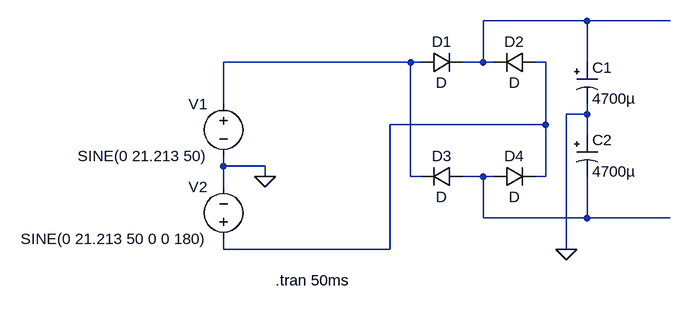
[diagram p0: schematic Rect and Filter.asc]
Rect and Filter.asc, the LTspice schematic file:
Version 4
SHEET 1 1676 728
WIRE 592 0 432 0
WIRE 720 0 592 0
WIRE 320 64 32 64
WIRE 336 64 320 64
WIRE 432 64 432 0
WIRE 432 64 400 64
WIRE 448 64 432 64
WIRE 528 64 512 64
WIRE 592 64 592 0
WIRE 32 128 32 64
WIRE 592 144 592 128
WIRE 592 144 560 144
WIRE 528 160 528 64
WIRE 528 160 288 160
WIRE 592 176 592 144
WIRE 32 224 32 208
WIRE 96 224 32 224
WIRE 96 240 96 224
WIRE 320 240 320 64
WIRE 336 240 320 240
WIRE 432 240 400 240
WIRE 448 240 432 240
WIRE 528 240 528 160
WIRE 528 240 512 240
WIRE 32 256 32 224
WIRE 432 304 432 240
WIRE 592 304 592 240
WIRE 592 304 432 304
WIRE 720 304 592 304
WIRE 32 352 32 336
WIRE 288 352 288 160
WIRE 288 352 32 352
WIRE 560 352 560 144
FLAG 560 352 0
FLAG 96 240 0
SYMBOL diode 336 80 R270
WINDOW 0 32 32 VTop 2
WINDOW 3 0 32 VBottom 2
SYMATTR InstName D1
SYMBOL diode 512 80 M270
WINDOW 0 32 32 VTop 2
WINDOW 3 0 32 VBottom 2
SYMATTR InstName D2
SYMBOL diode 400 256 M270
WINDOW 0 32 32 VTop 2
WINDOW 3 0 32 VBottom 2
SYMATTR InstName D3
SYMBOL diode 448 256 R270
WINDOW 0 32 32 VTop 2
WINDOW 3 0 32 VBottom 2
SYMATTR InstName D4
SYMBOL polcap 576 64 R0
SYMATTR InstName C1
SYMATTR Value 4700µ
SYMBOL polcap 576 176 R0
SYMATTR InstName C2
SYMATTR Value 4700µ
SYMBOL voltage 32 112 M0
WINDOW 123 0 0 Left 0
WINDOW 39 24 124 Left 2
SYMATTR InstName V1
SYMATTR Value SINE(0 21.213 50)
SYMBOL voltage 32 352 R180
WINDOW 0 24 96 Left 2
WINDOW 3 24 16 Left 2
WINDOW 123 0 0 Left 0
WINDOW 39 0 0 Left 0
SYMATTR InstName V2
SYMATTR Value SINE(0 21.213 50 0 0 180)
TEXT 112 400 Left 2 !.tran 50ms

The netlist it stands for:
* Rect and Filter.asc
D1 N002 N001 D
D2 N003 N001 D
D3 N004 N002 D
D4 N004 N003 D
C1 N001 0 4700µ
C2 0 N004 4700µ
V1 N002 0 SINE(0 21.213 50)
V2 N003 0 SINE(0 21.213 50 0 0 180)
.model D D
.lib standard.dio
.tran 50ms
.backanno
.end